# EAGLE schematic canon (EAGLE 5.10)
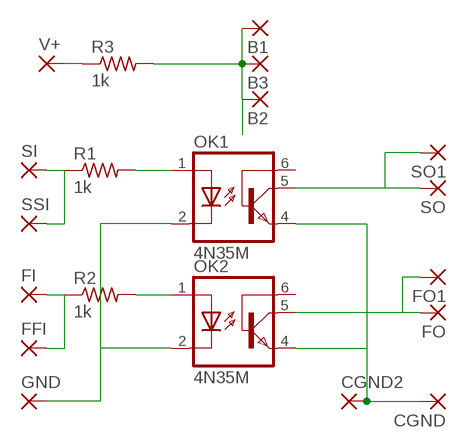
[diagram p0: schematic, sheet 1]

## Parts
B1  2,54/0,8  [2,54/0,8]
B2  2,54/0,8  [2,54/0,8]
B3  2,54/0,8  [2,54/0,8]
CGND  2,54/0,8  [2,54/0,8]
CGND2  3,17/1,1  [3,17/1,1]
FFI  3,17/1,1  [3,17/1,1]
FI  2,54/0,8  [2,54/0,8]
FO  2,54/0,8  [2,54/0,8]
FO1  2,54/0,8  [2,54/0,8]
GND  2,54/0,8  [2,54/0,8]
OK1  4N35M  [DIL06]
OK2  4N35M  [DIL06]
R1  1k  R-US_0207/10  [0207/10]
R2  1k  R-US_0207/10  [0207/10]
R3  1k  R-US_0207/10  [0207/10]
SI  2,54/0,8  [2,54/0,8]
SO  2,54/0,8  [2,54/0,8]
SO1  2,54/0,8  [2,54/0,8]
SSI  3,17/1,1  [3,17/1,1]
V+  2,54/0,8  [2,54/0,8]

## Nets
N$1: OK1.1(A) R1.2
N$2: OK2.1(A) R2.2
N$3: R3.1 V+.1(P)
N$4: B1.1(P) B2.1(P) B3.1(P) R3.2
N$5: FO1.1(P) FO.1(P) OK2.5(COL)
N$6: GND.1(P) OK1.2(C) OK2.2(C)
N$7: OK1.5(COL) SO1.1(P) SO.1(P)
N$8: FFI.1(P) FI.1(P) R2.1
N$9: R1.1 SI.1(P) SSI.1(P)
N$10: CGND2.1(P) CGND.1(P) OK1.4(EMI) OK2.4(EMI)
Unconnected: OK1.6(BAS) OK2.6(BAS)

## Library data of the parts
B1-B3 CGND FI FO FO1 GND SI SO SO1 V+ = wirepad:2,54/0,8: THROUGH-HOLE PAD
CGND2 FFI SSI = wirepad:3,17/1,1: THROUGH-HOLE PAD
OK1 OK2 = optocoupler:4N*?M: General Purpose 6-Pin Phototransistor Optocouplers Source: http://www.fairchildsemi.com/ds/4N/4N35-M.pdf
R1-R3 = resistor:R-US_: RESISTOR, American symbol

## Net classes
1 A1: width 1.981 mm, drill 0.991 mm, clearance 0.635 mm